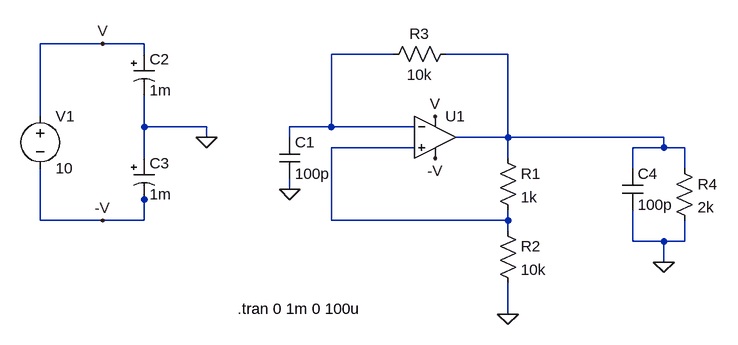
[diagram p0: schematic squarewavetl081.asc]
squarewavetl081.asc, the LTspice schematic file:
Version 4
SHEET 1 880 692
WIRE -336 112 -432 112
WIRE -272 112 -336 112
WIRE -272 128 -272 112
WIRE 112 128 16 128
WIRE 288 128 192 128
WIRE -432 224 -432 112
WIRE -272 240 -272 192
WIRE -176 240 -272 240
WIRE 16 240 16 128
WIRE 16 240 -48 240
WIRE 144 240 16 240
WIRE -176 256 -176 240
WIRE -48 256 -48 240
WIRE 288 256 288 128
WIRE 288 256 208 256
WIRE 528 256 288 256
WIRE 144 272 16 272
WIRE 528 272 528 256
WIRE 528 272 480 272
WIRE 560 272 528 272
WIRE -272 288 -272 240
WIRE 288 288 288 256
WIRE 480 304 480 272
WIRE 560 304 560 272
WIRE -48 336 -48 320
WIRE -272 352 -272 336
WIRE -432 384 -432 304
WIRE -336 384 -432 384
WIRE -272 384 -272 352
WIRE -272 384 -336 384
WIRE 16 384 16 272
WIRE 288 384 288 368
WIRE 288 384 16 384
WIRE 288 400 288 384
WIRE 480 416 480 368
WIRE 528 416 480 416
WIRE 560 416 560 384
WIRE 560 416 528 416
WIRE 528 448 528 416
WIRE 288 528 288 480
FLAG 288 528 0
FLAG -48 336 0
FLAG 176 224 V
FLAG 176 288 -V
FLAG -176 256 0
FLAG -336 112 V
FLAG -336 384 -V
FLAG 528 448 0
SYMBOL voltage -432 208 R0
WINDOW 123 0 0 Left 0
WINDOW 39 0 0 Left 0
SYMATTR InstName V1
SYMATTR Value 10
SYMBOL cap -64 256 R0
SYMATTR InstName C1
SYMATTR Value 100p
SYMBOL res 272 272 R0
SYMATTR InstName R1
SYMATTR Value 1k
SYMATTR SpiceLine tol=5
SYMBOL res 272 384 R0
SYMATTR InstName R2
SYMATTR Value 10k
SYMATTR SpiceLine tol=5
SYMBOL res 208 112 R90
WINDOW 0 0 56 VBottom 0
WINDOW 3 32 56 VTop 0
SYMATTR InstName R3
SYMATTR Value 10k
SYMATTR SpiceLine tol=5
SYMBOL Opamps\\UniversalOpamp 176 256 R0
SYMATTR InstName U1
SYMATTR SpiceModel level3b
SYMATTR Value2 Avol=0.2Meg GBW=3Meg Slew=13Meg
SYMATTR SpiceLine ilimit=25m rail=0 Vos=0 phimargin=0
SYMATTR SpiceLine2 en=0 enk=0 in=0 ink=0 Rin=1Meg
SYMBOL polcap -288 128 R0
SYMATTR InstName C2
SYMATTR Value 1m
SYMBOL polcap -288 288 R0
SYMATTR InstName C3
SYMATTR Value 1m
SYMBOL cap 464 304 R0
SYMATTR InstName C4
SYMATTR Value 100p
SYMBOL res 544 288 R0
SYMATTR InstName R4
SYMATTR Value 2k
TEXT -128 520 Left 0 !.tran 0 1m 0 100u

The netlist it stands for:
* squarewavetl081.asc
V1 V -V 10
C1 N001 0 100p
R1 N002 N003 1k tol=5
R2 N003 0 10k tol=5
R3 N002 N001 10k tol=5
XU1 N003 N001 V -V N002 level3b Avol=0.2Meg GBW=3Meg Slew=13Meg ilimit=25m rail=0 Vos=0 phimargin=0 en=0 enk=0 in=0 ink=0 Rin=1Meg  ; pins In+ In- V+ V- OUT
C2 V 0 1m
C3 0 -V 1m
C4 N002 0 100p
R4 N002 0 2k
.tran 0 1m 0 100u
.lib UniversalOpAmp1.lib
.backanno
.end